# EAGLE design diseno_eagle_v1.10 (EAGLE 9.6.2)
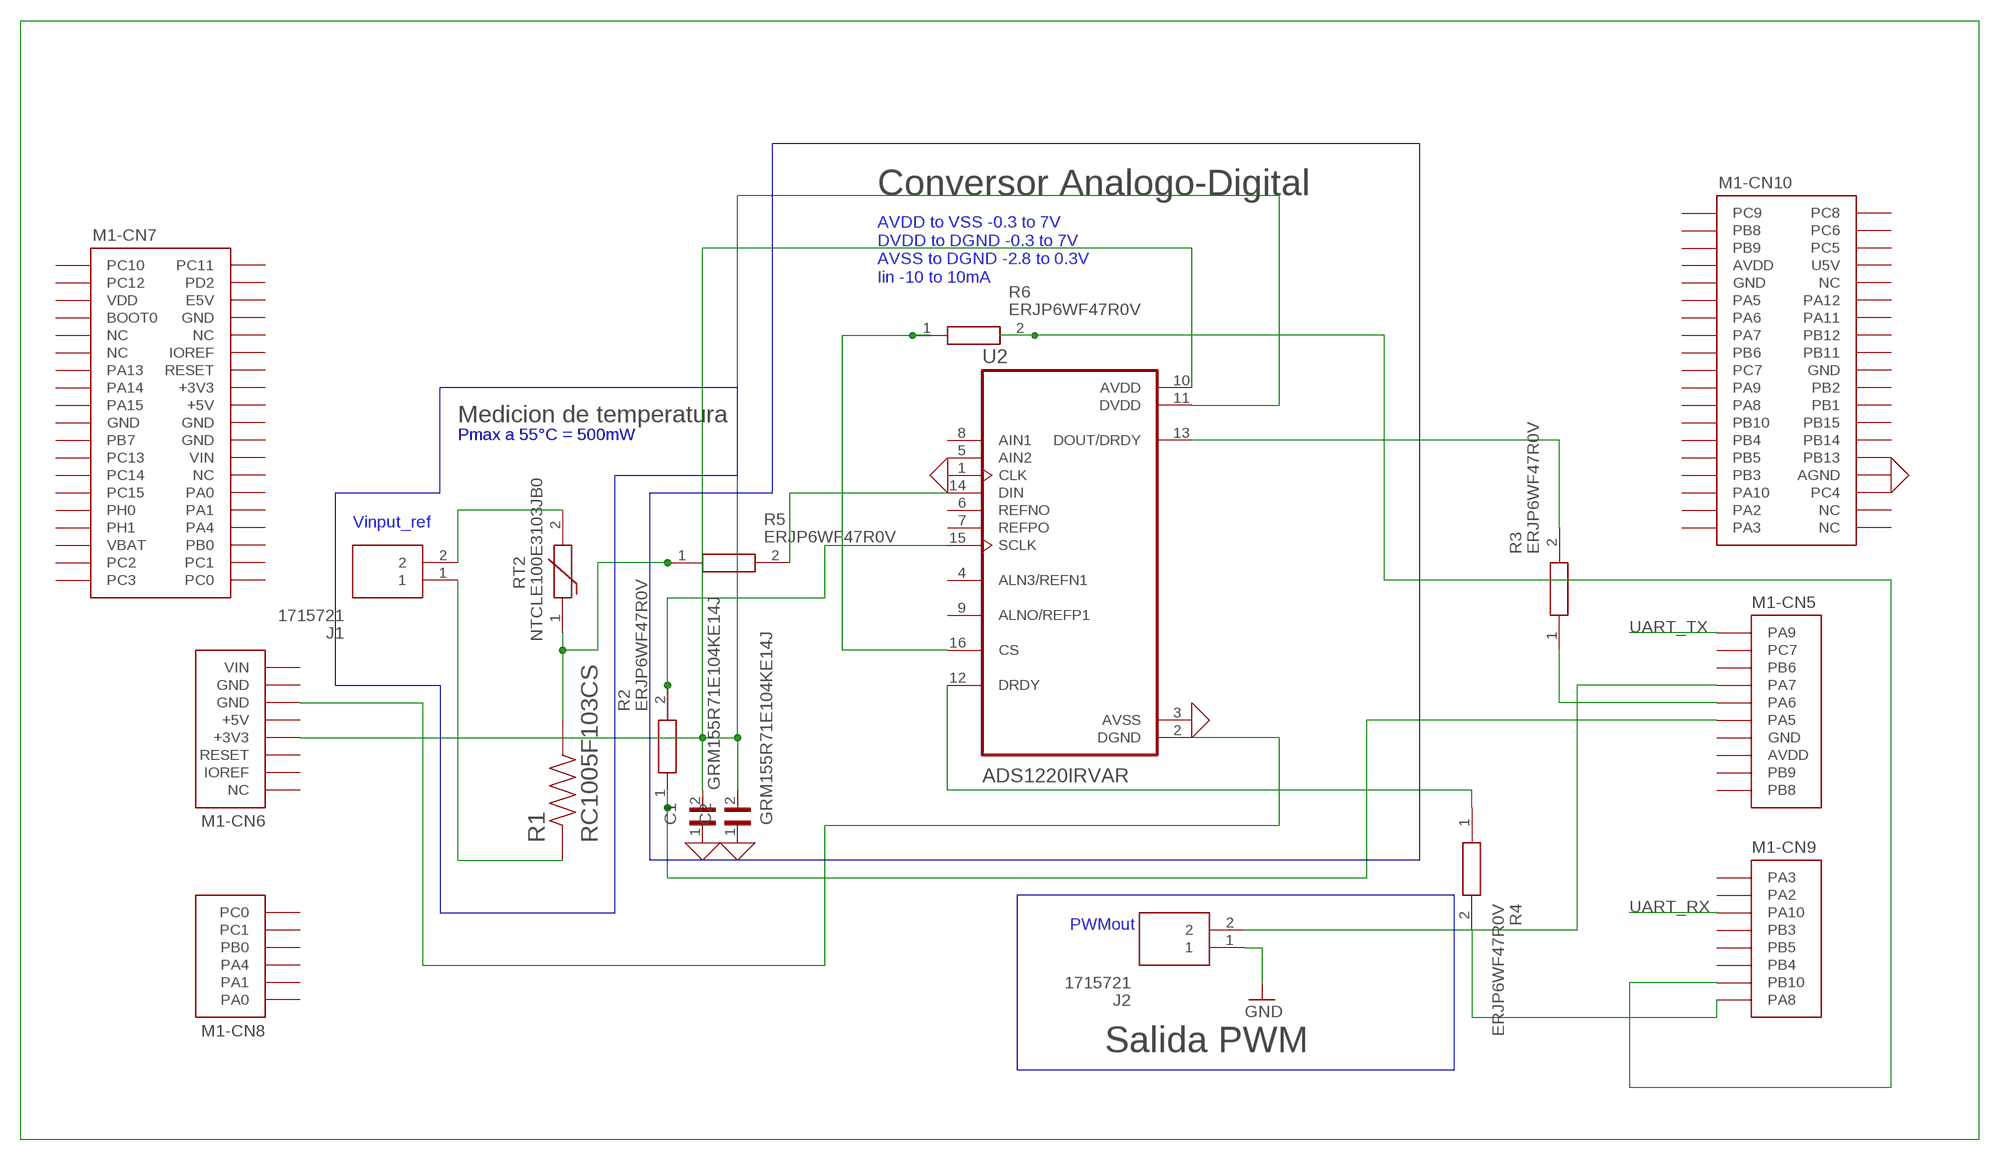
[diagram p0: schematic, sheet 1]

## Parts
C1  GRM155R71E104KE14J  [CAPC1005X55N]
C2  GRM155R71E104KE14J  [CAPC1005X55N]
J1  1715721  [1715721]
J2  1715721  [1715721]
M1  NUCLEO-L452RE  [NUCLEO-64]
R1  RC1005F103CS  [RESC1005X40N]
R2  ERJP6WF47R0V  [RESC2012X75N]
R3  ERJP6WF47R0V  [RESC2012X75N]
R4  ERJP6WF47R0V  [RESC2012X75N]
R5  ERJP6WF47R0V  [RESC2012X75N]
R6  ERJP6WF47R0V  [RESC2012X75N]
RT2  NTCLE100E3103JB0  [NTCLE100E3103JB0]
U2  ADS1220IRVAR  [QFN50P350X350X100-17N]

## Nets
0: C1.1 C2.1 M1.CN10-32(-CN10:AGND) U2.1(CLK) U2.3(AVSS) ; supply symbol labelled GND
GND: J2.1
N$1: R4.1 U2.12(DRDY)
N$2: R3.2 U2.13(DOUT/DRDY)
N$3: R1.2 R5.1 RT2.1
N$4: M1.CN5-6(-CN5:PA5) R2.1
N$5: M1.CN9-7(-CN9:PB10) R6.2
N$6: M1.CN5-5(-CN5:PA6) R3.1
N$7: C1.2 C2.2 M1.CN6-4(-CN6:+3V3) U2.10(AVDD) U2.11(DVDD)
N$8: M1.CN6-6(-CN6:GND) U2.2(DGND)
N$9: M1.CN9-8(-CN9:PA8) R4.2
N$10: J1.2 RT2.2
N$11: R5.2 U2.14(DIN)
N$12: J1.1 R1.1
N$15: J2.2 M1.CN5-4(-CN5:PA7)
N$16: R6.1 U2.16(CS)
N$17: R2.2 U2.15(SCLK)
UART_RX: M1.CN9-3(-CN9:PA10)
UART_TX: M1.CN5-1(-CN5:PA9)
Unconnected: M1.CN5-2(-CN5:PC7) M1.CN5-3(-CN5:PB6) M1.CN5-9(-CN5:PB9) M1.CN5-10(-CN5:PB8) M1.CN6-1(-CN6:NC) M1.CN6-3(-CN6:RESET) M1.CN7-1(-CN7:PC10) M1.CN7-2(-CN7:PC11) M1.CN7-3(-CN7:PC12) M1.CN7-4(-CN7:PD2) M1.CN7-6(-CN7:E5V) M1.CN7-7(-CN7:BOOT0) M1.CN7-9(-CN7:NC) M1.CN7-10(-CN7:NC) M1.CN7-11(-CN7:NC) M1.CN7-12(-CN7:IOREF) M1.CN7-13(-CN7:PA13) M1.CN7-14(-CN7:RESET) M1.CN7-15(-CN7:PA14) M1.CN7-17(-CN7:PA15) M1.CN7-21(-CN7:PB7) M1.CN7-23(-CN7:PC13) M1.CN7-25(-CN7:PC14) M1.CN7-26(-CN7:NC) M1.CN7-27(-CN7:PC15) M1.CN7-28(-CN7:PA0) M1.CN7-29(-CN7:PH0) M1.CN7-30(-CN7:PA1) M1.CN7-31(-CN7:PH1) M1.CN7-32(-CN7:PA4) M1.CN7-34(-CN7:PB0) M1.CN7-35(-CN7:PC2) M1.CN7-36(-CN7:PC1) M1.CN7-37(-CN7:PC3) M1.CN7-38(-CN7:PC0) M1.CN8-1(-CN8:PA0) M1.CN8-2(-CN8:PA1) M1.CN8-3(-CN8:PA4) M1.CN8-4(-CN8:PB0) M1.CN8-5(-CN8:PC1) M1.CN8-6(-CN8:PC0) M1.CN9-1(-CN9:PA3) M1.CN9-2(-CN9:PA2) M1.CN9-4(-CN9:PB3) M1.CN9-5(-CN9:PB5) M1.CN9-6(-CN9:PB4) M1.CN10-1(-CN10:PC9) M1.CN10-2(-CN10:PC8) M1.CN10-3(-CN10:PB8) M1.CN10-4(-CN10:PC6) M1.CN10-5(-CN10:PB9) M1.CN10-6(-CN10:PC5) M1.CN10-10(-CN10:NC) M1.CN10-11(-CN10:PA5) M1.CN10-12(-CN10:PA12) M1.CN10-13(-CN10:PA6) M1.CN10-14(-CN10:PA11) M1.CN10-15(-CN10:PA7) M1.CN10-16(-CN10:PB12) M1.CN10-17(-CN10:PB6) M1.CN10-18(-CN10:PB11) M1.CN10-19(-CN10:PC7) M1.CN10-21(-CN10:PA9) M1.CN10-22(-CN10:PB2) M1.CN10-23(-CN10:PA8) M1.CN10-24(-CN10:PB1) M1.CN10-25(-CN10:PB10) M1.CN10-26(-CN10:PB15) M1.CN10-27(-CN10:PB4) M1.CN10-28(-CN10:PB14) M1.CN10-29(-CN10:PB5) M1.CN10-30(-CN10:PB13) M1.CN10-31(-CN10:PB3) M1.CN10-33(-CN10:PA10) M1.CN10-34(-CN10:PC4) M1.CN10-35(-CN10:PA2) M1.CN10-36(-CN10:NC) M1.CN10-37(-CN10:PA3) M1.CN10-38(-CN10:NC) U2.4(ALN3/REFN1) U2.5(AIN2) U2.6(REFNO) U2.7(REFPO) U2.8(AIN1) U2.9(ALNO/REFP1)

## Buses
B$2
B$3
B$4

## Notes on the sheet
- Conversor Analogo-Digital
- AVDD to VSS -0.3 to 7V
  DVDD to DGND -0.3 to 7V
  AVSS to DGND -2.8 to 0.3V
  Iin -10 to 10mA
- Medicion de temperatura
- Pmax a 55°C = 500mW
- Vinput_ref
- PWMout
- Salida PWM

## Power pins joined to a net without a drawn wire
+3V3: M1.CN7-16(-CN7:+3V3)
+5V: M1.CN6-5(-CN6:+5V) M1.CN7-18(-CN7:+5V)
AVDD: M1.CN5-8(-CN5:AVDD) M1.CN10-7(-CN10:AVDD)
GND: M1.CN5-7(-CN5:GND) M1.CN6-7(-CN6:GND) M1.CN7-8(-CN7:GND) M1.CN7-19(-CN7:GND) M1.CN7-20(-CN7:GND) M1.CN7-22(-CN7:GND) M1.CN10-9(-CN10:GND) M1.CN10-20(-CN10:GND)
IOREF: M1.CN6-2(-CN6:IOREF)
U5V: M1.CN10-8(-CN10:U5V)
VBAT: M1.CN7-33(-CN7:VBAT)
VDD: M1.CN7-5(-CN7:VDD)
VIN: M1.CN6-8(-CN6:VIN) M1.CN7-24(-CN7:VIN)

## Library data of the parts
C1 C2 = GRM155R71E104KE14J:GRM155R71E104KE14J: SMD Capacitor X7R(EIA) with Capacitance: 0.10uF Tol. 10%. Rated Voltage: 25Vdc; CHECK_PRICES: https://www.snapeda.com/parts/GRM155R71E104KE14J/Murata+Electronics+North+America/view-part/?ref=eda; DESCRIPTION: SMD capacitor X7R(EIA) with capacitance 0.10uF Tol.10%. Rated voltage 25Vdc 125C; MF: Murata Electronics; MP: GRM155R71E104KE14J; PACKAGE: 1005 Taiyo Yuden; PURCHASE-URL: https://www.snapeda.com/api/url_track_click_mouser/?unipart_id=1797567&manufacturer=Murata Electronics&part_name=GRM155R71E104KE14J&search_term=grm155r71e104ke14j; SNAPEDA_LINK: https://www.snapeda.com/parts/GRM155R71E104KE14J/Murata+Electronics+North+America/view-part/?ref=snap
J1 J2 = 1715721:1715721: PCB terminal block, nominal current: 17.5 A, rated voltage (III/2): 400 V, nominal cross section: 1.5 mm?, Number of potentials: 2, Number of rows: 1, Number of positions per row: 2, product range: MKDS 1,5, pitch: 5.08 mm, connection method: Screw connection with tension sleeve, mounting: Wave soldering, conductor/PCB connection direction: 0 ?, color: green, Pin layout: Linear pinning, Solder pin [P]: 3.5 mm, type of packaging: packed in cardboard. The article can be aligned to create different nos. of pos Source: Datasheet <http://www.phoenixcontact.com/de/produkte/1715721/pdf>; DESCRIPTION: PCB terminal block, nominal current: 17.5 A, rated voltage (III/2): 400 V, nominal cross section: 1.5 mm?, Number of potentials: 2, Number of rows: 1, Number of positions per row: 2, product range: MKDS 1,5, pitch: 5.08 mm, connection method: Screw connection with tension sleeve, mounting: Wave soldering, conductor/PCB connection direction: 0 ?, color: green, Pin layout: Linear pinning, Solder pin [P]: 3.5 mm, type of packaging: packed in cardboard. The article can be aligned to create different nos. of pos; HEIGHT: 13.95mm; MANUFACTURER_NAME: Phoenix Contact; MANUFACTURER_PART_NUMBER: 1715721
M1 = NUCLEO-L452RE:NUCLEO-L452RE: No existe un outline (Layer Dimension) para esta librería. En su lugar se utilizó una referencia en tDocu. Al momento de diseñar la tarjeta, el Dimension debe ser dibujado según los requerimientos del usuario, o simplemente copiar los contenidos del tDocu en Dimensions.
R1 = RC1005F103CS:RC1005F103CS: Check availability <https://pricing.snapeda.com/parts/RC1005F103CS/Samsung%20Electro-Mechanics/view-part?ref=eda>; AVAILABILITY: In Stock; CHECK_PRICES: https://www.snapeda.com/parts/RC1005F103CS/Samsung+Electro-Mechanics/view-part/?ref=eda; DESCRIPTION: 10 kOhms ±1% 0.063W, 1/16W Chip Resistor 0402 (1005 Metric) Moisture Resistant Thick Film; MF: Samsung Electro-Mechanics; MP: RC1005F103CS; PACKAGE: 1005 Panasonic Electronic Components; PRICE: None; PURCHASE-URL: https://www.snapeda.com/api/url_track_click_mouser/?unipart_id=579623&manufacturer=Samsung Electro-Mechanics&part_name=RC1005F103CS&search_term=rc1005f103cs; SNAPEDA_LINK: https://www.snapeda.com/parts/RC1005F103CS/Samsung+Electro-Mechanics/view-part/?ref=snap
R2-R6 = ERJP6WF47R0V:ERJP6WF47R0V: Panasonic ERJP6W Series Thick Film Surface Mount Fixed Resistor 0805 Case 47 +/-1% 0.5W +/-200ppm/C Source: Datasheet <https://industrial.panasonic.com/cdbs/www-data/pdf/RDA0000/AOA0000C243.pdf>; DESCRIPTION: Panasonic ERJP6W Series Thick Film Surface Mount Fixed Resistor 0805 Case 47 +/-1% 0.5W +/-200ppm/C; HEIGHT: 0.75mm; MANUFACTURER_NAME: Panasonic; MANUFACTURER_PART_NUMBER: ERJP6WF47R0V
RT2 = NTCLE100E3103JB0:NTCLE100E3103JB0: Vishay NTCLE100E3103JB0 Thermistor 10k, 3.3 x 3 x 9mm Source: Datasheet; DESCRIPTION: Vishay NTCLE100E3103JB0 Thermistor 10k, 3.3 x 3 x 9mm; HEIGHT: 10mm; MANUFACTURER_NAME: Vishay; MANUFACTURER_PART_NUMBER: NTCLE100E3103JB0
U2 = ADS1220IRVAR :ADS1220IRVAR; CHECK_PRICES: https://www.snapeda.com/parts/ADS1220IRVAR/Texas+Instruments/view-part/?ref=eda; DESCRIPTION: 24-bit, 2-kSPS, four-channel, low-power, delta-sigma ADC with PGA, VREF, SPI and two IDACs; MF: Texas Instruments; MP: ADS1220IRVAR; PACKAGE: VQFN-16 Texas Instruments; PURCHASE-URL: https://www.snapeda.com/api/url_track_click_mouser/?unipart_id=47464&manufacturer=Texas Instruments&part_name=ADS1220IRVAR&search_term=ads1220; SNAPEDA_LINK: https://www.snapeda.com/parts/ADS1220IRVAR/Texas+Instruments/view-part/?ref=snap

## Board
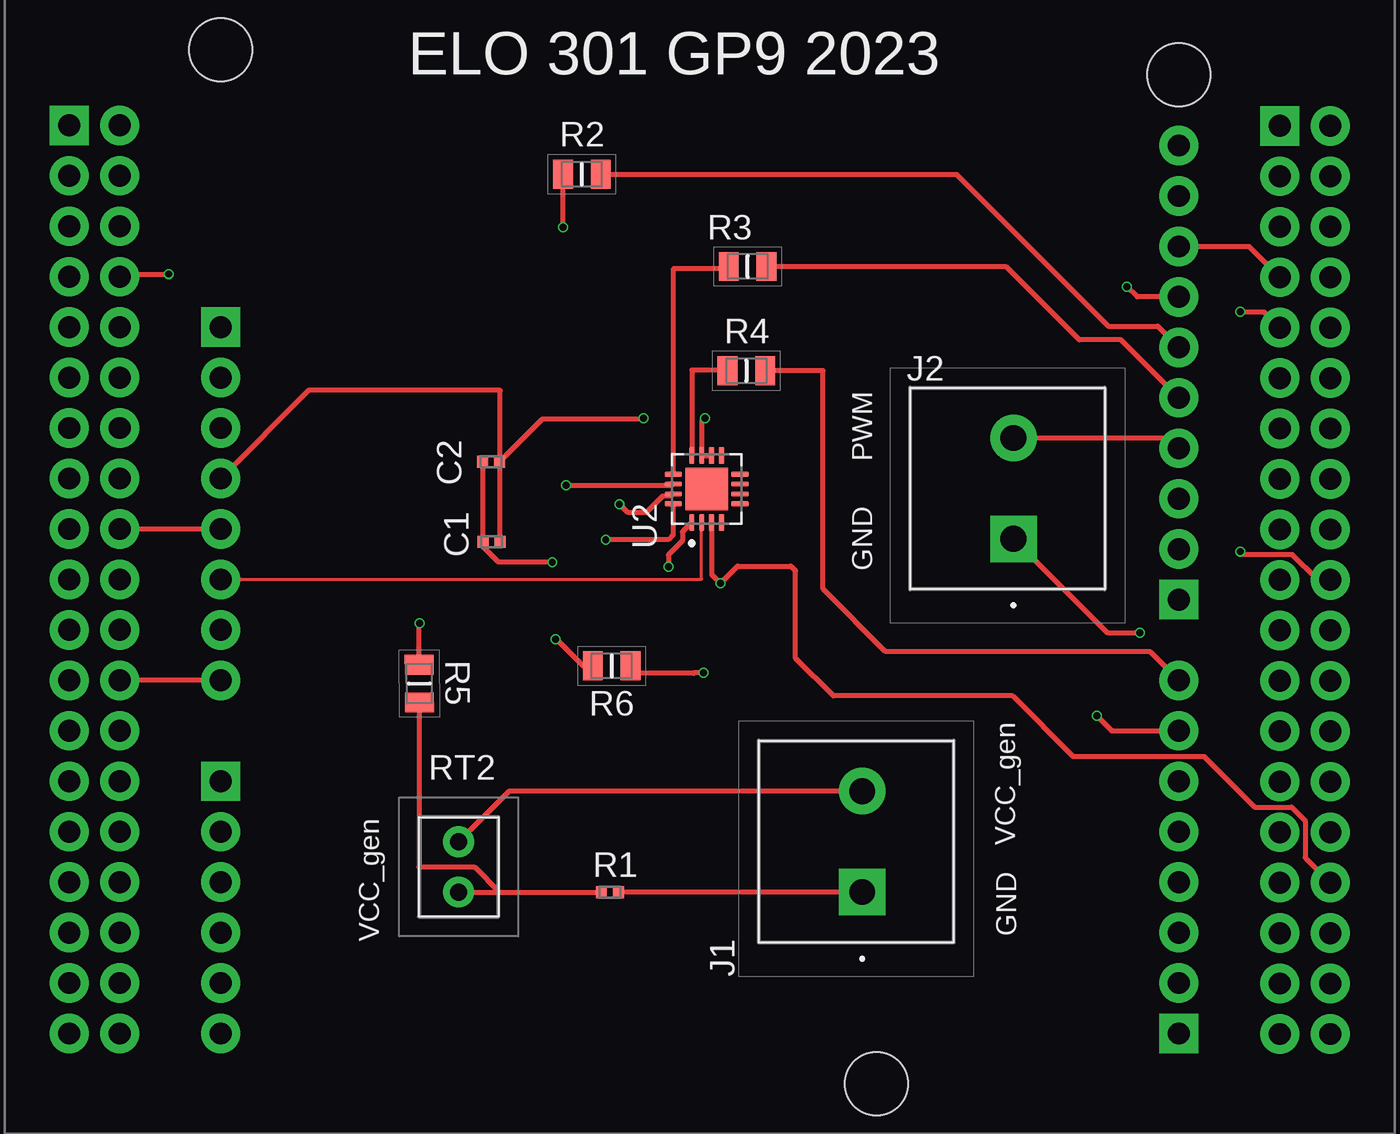
[diagram p1: board, top side]
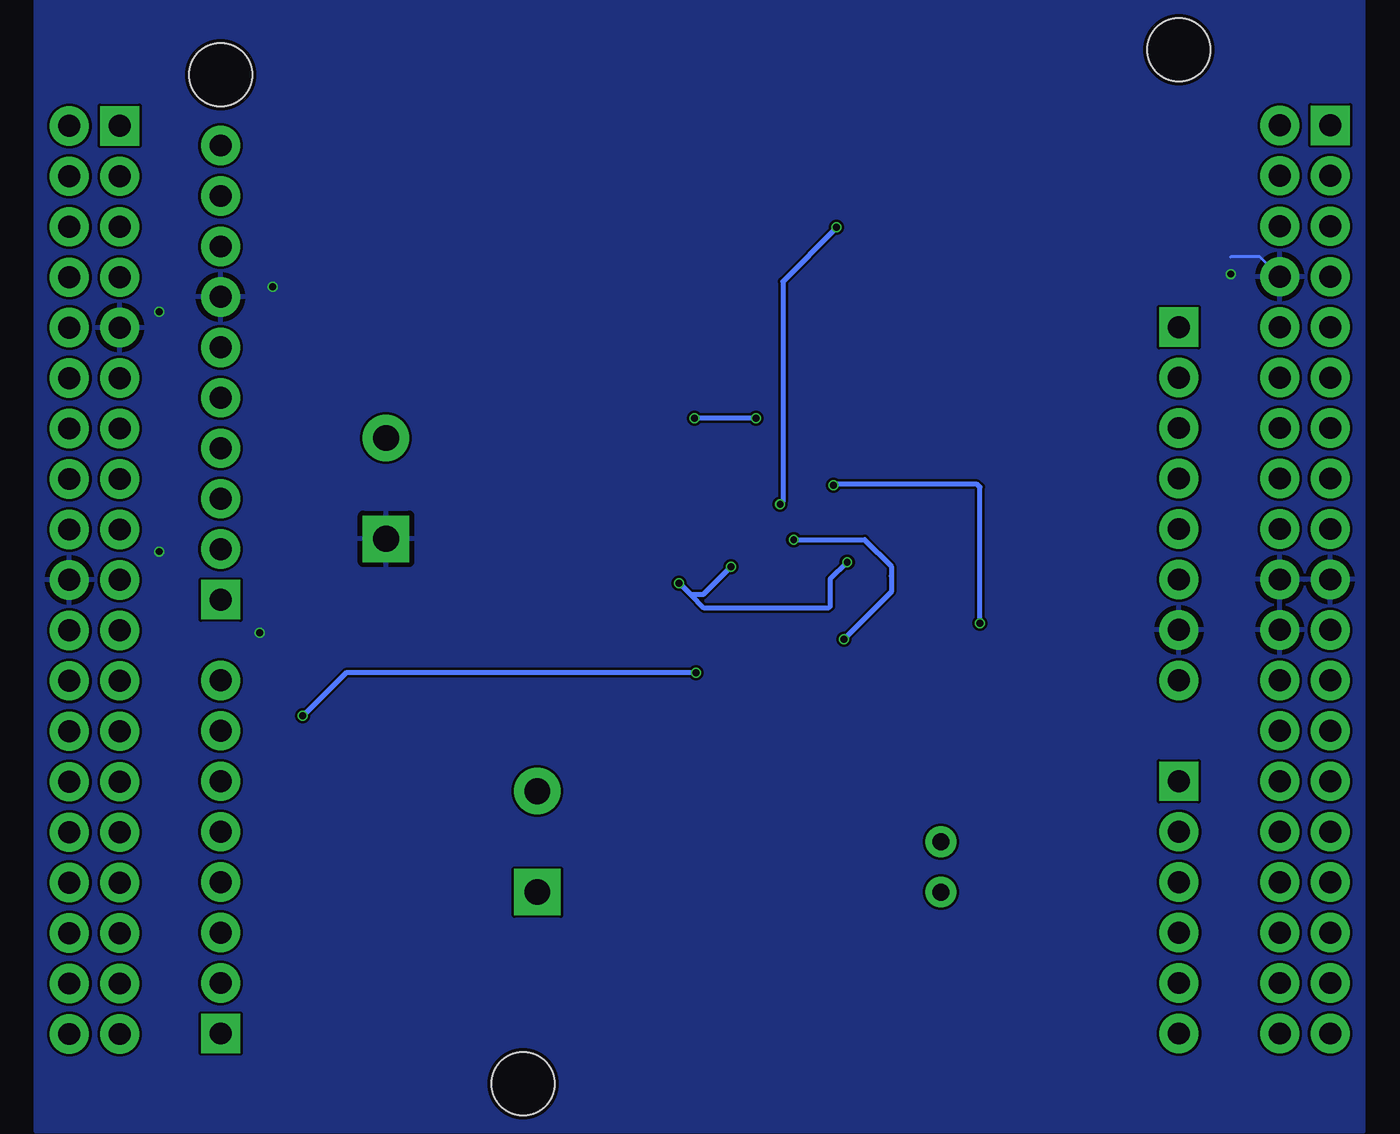
[diagram p2: board, bottom side, seen from below]

No outline drawn. Coordinates in mm, seen from the top.
Copper layers (1*16): Top 0.035mm / dielectric 1.6mm / Bottom 0.035mm
Design rules "jlcpcb-2layers *": minimum track width 5mil, minimum drill 0.3mm, track to track 5mil, track to pad 5mil, pad to pad 5mil, via to via 5mil, smd to smd 5mil, copper to edge 0.2mm, drill to drill 6mil, minimum pad ring 10mil, minimum via ring 3mil, stop-mask expansion 4mil, vias tented up to drill 15mil, thermal gap 10mil

### Footprints (pad centres in the part's own frame; a part is rotated, then mirrored left to right if it is on the bottom)
CAPC1005X55N = smd 0.54 x 0.6: 1 -0.432,0; 2 0.432,0
1715721 = drill 1.3 pad 1.95 square: 1 0,0 | drill 1.3 pad 1.95: 2 5.08,0
NUCLEO-64 = drill 1.1 pad 1.85 square: CN5-1 59.13,24.884; CN6-1 10.87,38.6; CN7-1 3.25,48.76; CN8-1 10.87,15.74; CN9-1 59.13,3.04; CN10-1 64.21,48.735 | drill 1.1 pad 1.85: CN5-2 59.13,27.424; CN5-3 59.13,29.964; CN5-4 59.13,32.504; CN5-5 59.13,35.044; CN5-6 59.13,37.584; CN5-7 59.13,40.124; CN5-8 59.13,42.664; CN5-9 59.13,45.204; CN5-10 59.13,47.744; CN6-2 10.87,36.06; CN6-3 10.87,33.52; CN6-4 10.87,30.98; CN6-5 10.87,28.44; CN6-6 10.87,25.9; CN6-7 10.87,23.36; CN6-8 10.87,20.82; CN7-2 5.79,48.76; CN7-3 3.25,46.22; CN7-4 5.79,46.22; CN7-5 3.25,43.68; CN7-6 5.79,43.68; CN7-7 3.25,41.14; CN7-8 5.79,41.14; CN7-9 3.25,38.6; CN7-10 5.79,38.6; CN7-11 3.25,36.06; CN7-12 5.79,36.06; CN7-13 3.25,33.52; CN7-14 5.79,33.52; CN7-15 3.25,30.98; CN7-16 5.79,30.98; CN7-17 3.25,28.44; CN7-18 5.79,28.44; CN7-19 3.25,25.9; CN7-20 5.79,25.9; CN7-21 3.25,23.36; CN7-22 5.79,23.36; CN7-23 3.25,20.82; CN7-24 5.79,20.82; CN7-25 3.25,18.28; CN7-26 5.79,18.28; CN7-27 3.25,15.74; CN7-28 5.79,15.74; CN7-29 3.25,13.2; CN7-30 5.79,13.2; CN7-31 3.25,10.66; CN7-32 5.79,10.66; CN7-33 3.25,8.12; CN7-34 5.79,8.12; CN7-35 3.25,5.58; CN7-36 5.79,5.58; CN7-37 3.25,3.04; CN7-38 5.79,3.04; CN8-2 10.87,13.2; CN8-3 10.87,10.66; CN8-4 10.87,8.12; CN8-5 10.87,5.58; CN8-6 10.87,3.04; CN9-2 59.13,5.58; CN9-3 59.13,8.12; CN9-4 59.13,10.66; CN9-5 59.13,13.2; CN9-6 59.13,15.74; CN9-7 59.13,18.28; CN9-8 59.13,20.82; CN10-2 66.75,48.735; CN10-3 64.21,46.195; CN10-4 66.75,46.195; CN10-5 64.21,43.655; CN10-6 66.75,43.655; CN10-7 64.21,41.115; CN10-8 66.75,41.115; CN10-9 64.21,38.575; CN10-10 66.75,38.575; CN10-11 64.21,36.035; CN10-12 66.75,36.035; CN10-13 64.21,33.495; CN10-14 66.75,33.495; CN10-15 64.21,30.955; CN10-16 66.75,30.955; CN10-17 64.21,28.415; CN10-18 66.75,28.415; CN10-19 64.21,25.875; CN10-20 66.75,25.875; CN10-21 64.21,23.335; CN10-22 66.75,23.335; CN10-23 64.21,20.795; CN10-24 66.75,20.795; CN10-25 64.21,18.255; CN10-26 66.75,18.255; CN10-27 64.21,15.715; CN10-28 66.75,15.715; CN10-29 64.21,13.175; CN10-30 66.75,13.175; CN10-31 64.21,10.635; CN10-32 66.75,10.635; CN10-33 64.21,8.095; CN10-34 66.75,8.095; CN10-35 64.21,5.555; CN10-36 66.75,5.555; CN10-37 64.21,3.015; CN10-38 66.75,3.015 | hole 3.175: 59.13,51.3; 10.87,52.57; 43.89,0.5
RESC1005X40N = smd 0.54 x 0.6: 1 -0.432,0; 2 0.432,0
RESC2012X75N = smd 1 x 1.45: 1 -0.95,0; 2 0.95,0
NTCLE100E3103JB0 = drill 0.86 pad 1.397: 1 0,0; 2 2.54,0
QFN50P350X350X100-17N = smd 0.86 x 0.26: 1 -1.685,0.75; 2 -1.685,0.25; 3 -1.685,-0.25; 4 -1.685,-0.75; 9 1.685,-0.75; 10 1.685,-0.25; 11 1.685,0.25; 12 1.685,0.75 | smd 0.26 x 0.86: 5 -0.75,-1.685; 6 -0.25,-1.685; 7 0.25,-1.685; 8 0.75,-1.685; 13 0.75,1.685; 14 0.25,1.685; 15 -0.25,1.685; 16 -0.75,1.685 | smd 2.14 x 2.14: 17 0,0

### Placement (x,y rotation side)
C1  24.52,27.79 0 top
C2  24.49,31.83 0 top
J1  43.18,10.16 90 top
J2  50.8,27.94 90 top
M1  0,0 0 top
R1  30.48,10.16 180 top
R2  29.06,46.3 180 top
R3  37.41,41.66 180 top
R4  37.35,36.41 0 top
R5  20.88,20.66 90.3 top
R6  30.56,21.55 0 top
RT2  22.86,10.16 90 top
U2  35.35,30.45 90 top

### Tracks (layer width: path | path; a pad name or v marks a point on that pad's centre or on a via)
0  (via drill 0.35)
  Top 0.25: 39.59,26.57 36.91,26.57 v36.05,25.71 35.6,26.16 U2.3 | U2.1 34.12,28.29 34.12,27.84 33.43,27.14 v33.43,26.54
  Top 0.254: C2.1 24.06,27.82 C1.1 24.08,27.55 24.86,26.77 v27.57,26.77 | M1.CN10-32 65.49,11.89 65.49,13.75 64.81,14.43 62.95,14.43 60.39,17 53.8,17 50.77,20.03 41.72,20.03 39.83,21.93 39.83,26.34 39.59,26.57
  Bottom 0.254: v27.57,26.77 28.43,25.91 28.43,24.55 28.52,24.46 34.77,24.46 35.45,25.13 | v36.05,25.71 36.03,25.71 35.45,25.13 | v33.43,26.54 34.83,25.13 35.45,25.13
+5V
  Top 0.254: M1.CN7-18 M1.CN6-5
AVDD
  Top 0.254: M1.CN5-8 62.66,42.66 M1.CN10-7
GND  (via drill 0.35)
  Top 0.254: J2.1 55.52,23.22 v57.16,23.22 | M1.CN5-7 57.03,40.12 v56.52,40.64 | v62.23,39.37 63.41,39.37 M1.CN10-9 | M1.CN10-20 66.12,25.88 64.85,27.14 62.39,27.14 v62.23,27.3 | M1.CN7-8 5.92,41.27 v8.26,41.27
  Bottom 0.152: M1.CN7-8 6.79,42.14 8.26,42.14
  pour Bottom: 1.53,55.3 68.48,55.3 68.48,-1.91 1.53,-1.91
N$1
  Top 0.25: R4.1 36.37,36.44 34.6,36.44 U2.12
N$2
  Top 0.25: R3.2 36.35,41.54 33.7,41.54 33.66,41.5 U2.13
N$3
  Top 0.254: RT2.1 24.92,10.16 | 24.92,10.16 R1.2 | 24.92,10.16 23.65,11.43 20.86,11.43 20.86,19.68 R5.1
N$4
  Top 0.254: R2.1 47.94,46.3 55.57,38.66 58.06,38.66 M1.CN5-6
N$5  (via drill 0.35)
  Top 0.254: R6.2 31.89,21.17 34.69,21.17 34.71,21.19 v35.19,21.19 | v54.99,19.04 55.75,18.28 M1.CN9-7
  Bottom 0.254: v35.19,21.19 52.81,21.19 54.97,19.04 v54.99,19.04
N$6
  Top 0.25: R3.1 50.41,41.66 50.54,41.53
  Top 0.254: M1.CN5-5 56.21,37.96 54.11,37.96 50.54,41.53
N$7  (via drill 0.35)
  Top 0.25: C2.2 27.08,33.99 32.16,33.99 v32.17,34.01 | v35.25,34.02 35.1,33.86 U2.11 U2.10
  Top 0.254: M1.CN6-4 15.3,35.41 24.95,35.41 24.95,31.86 C2.2 24.92,27.82 C1.2
  Bottom 0.25: v32.17,34.01 35.08,34.01 35.1,34.02 v35.25,34.02
N$8
  Top 0.152: M1.CN6-6 35.08,25.9 35.1,25.92 U2.2
  Top 0.254: 11.03,25.74 M1.CN6-6
N$9
  Top 0.25: 41.25,25.37 41.21,25.41 41.21,36.4 41.21,36.41 R4.2
  Top 0.254: 41.25,25.37 44.35,22.27 57.69,22.27 M1.CN9-8
N$10
  Top 0.254: J1.2 25.4,15.24 RT2.2
N$11  (via drill 0.35)
  Top 0.25: R5.2 20.87,23.67 v20.89,23.69 | v28.26,30.64 33.61,30.64 U2.14
  Bottom 0.25: v20.89,23.69 20.89,30.54 21.03,30.68 28.25,30.68 28.26,30.67 v28.26,30.64
N$12
  Top 0.254: J1.1 R1.1
N$15
  Top 0.254: J2.2 58.61,33.02 M1.CN5-4
N$16  (via drill 0.35)
  Top 0.25: U2.16 33.66,28.15 33.43,27.91 v30.27,27.91
  Top 0.254: v27.74,22.88 27.79,22.88 29.12,21.55 R6.1
  Bottom 0.25: v30.27,27.91 26.69,27.91 25.35,26.56 25.35,26.07
  Bottom 0.254: 25.35,26.07 25.35,25.27 v27.74,22.88 | v27.74,22.88
N$17  (via drill 0.35)
  Top 0.25: U2.15 33.57,30.11 33.14,30.11 32.29,29.26 31.4,29.26 30.97,29.69 v30.95,29.69
  Top 0.254: v30.96,29.68 v30.95,29.69 | v28.11,43.63 R2.2
  Bottom 0.254: v30.95,29.69 30.82,29.82 30.82,40.89 28.1,43.6 28.1,43.62 v28.11,43.63
VIN
  Top 0.254: M1.CN6-8 M1.CN7-24

### Text on the board
tPlace: ELO 301 GP9 2023 | PWM | GND | VCC_gen | VCC_gen | GND